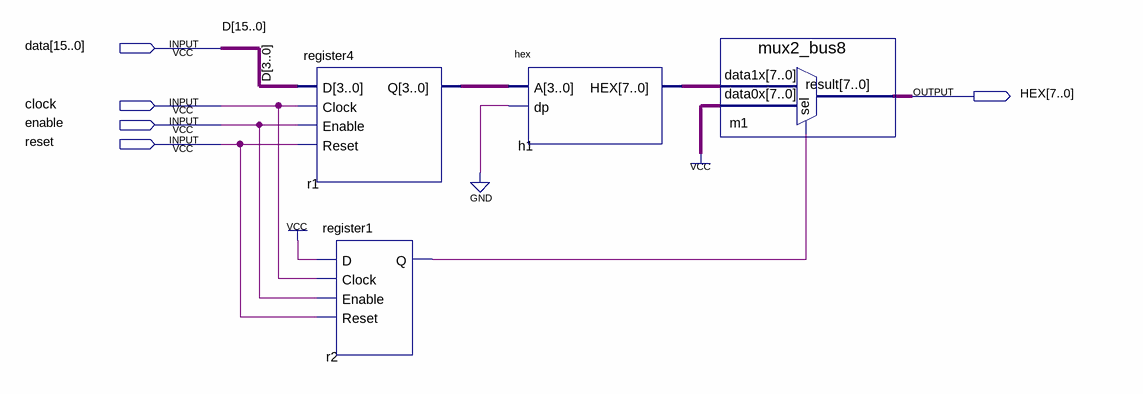
[diagram p0: schematic sheet]
// Quartus schematic hex_control.bdf as structural Verilog: 4 symbols, 5 pins
module hex_control (
  input  [15:0] data,
  input  clock,
  input  enable,
  input  reset,
  output [7:0] HEX
);

  wire r2_q;
  wire [3:0] r1_q;
  wire [7:0] h1_hex;

  register4 r1 (.D(data[3:0]), .Clock(clock), .Enable(enable), .Reset(reset), .Q(r1_q));
  register1 r2 (.D(1'b1), .Clock(clock), .Enable(enable), .Reset(reset), .Q(r2_q));
  hex h1 (.A(r1_q), .dp(1'b0), .HEX(h1_hex));
  mux2_bus8 m1 (.data1x(h1_hex), .data0x({8{1'b1}}), .sel(r2_q), .result(HEX));

  // Other names for the same wires on the sheet: D[15:0] = data
endmodule
